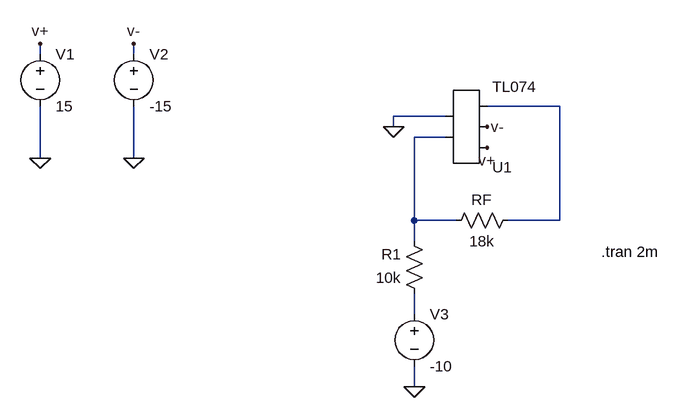
[diagram p0: schematic Multivibrador.asc]
Multivibrador.asc, the LTspice schematic file:
Version 4
SHEET 1 880 680
WIRE -256 80 -256 64
WIRE -112 80 -112 64
WIRE 544 160 432 160
WIRE 368 176 288 176
WIRE 288 192 288 176
WIRE 368 208 320 208
WIRE -256 240 -256 160
WIRE -112 240 -112 160
WIRE 320 336 320 208
WIRE 384 336 320 336
WIRE 544 336 544 160
WIRE 544 336 464 336
WIRE 320 368 320 336
WIRE 320 480 320 448
WIRE 320 592 320 560
FLAG 288 192 0
FLAG 432 224 v+
FLAG 432 192 v-
FLAG -256 240 0
FLAG -112 240 0
FLAG -256 64 v+
FLAG -112 64 v-
FLAG 320 592 0
SYMBOL res 480 320 R90
WINDOW 0 0 56 VBottom 2
WINDOW 3 32 56 VTop 2
SYMATTR InstName RF
SYMATTR Value 18k
SYMBOL res 336 464 R180
WINDOW 0 36 76 Left 2
WINDOW 3 36 40 Left 2
SYMATTR InstName R1
SYMATTR Value 10k
SYMBOL AutoGenerated/TL074 400 192 M180
SYMATTR InstName U1
SYMBOL voltage -256 64 R0
WINDOW 123 0 0 Left 2
WINDOW 39 0 0 Left 2
SYMATTR InstName V1
SYMATTR Value 15
SYMBOL voltage -112 64 R0
WINDOW 123 0 0 Left 2
WINDOW 39 0 0 Left 2
SYMATTR InstName V2
SYMATTR Value -15
SYMBOL voltage 320 464 R0
SYMATTR InstName V3
SYMATTR Value -10
TEXT 608 384 Left 2 !.tran 2m

The netlist it stands for:
* Multivibrador.asc
RF N001 N002 18k
R1 N003 N002 10k
* U1: TL074 (symbol AutoGenerated/TL074 not available, pins judged from their places): pin1=N002 pin2=0 pin3=v+ pin4=v- pin5=N001
V1 v+ 0 15
V2 v- 0 -15
V3 N003 0 -10
.tran 2m
.backanno
.end